# Altium schematic sheet STM32F030C8T6_IC.schdoc
size 123 x 93 mm
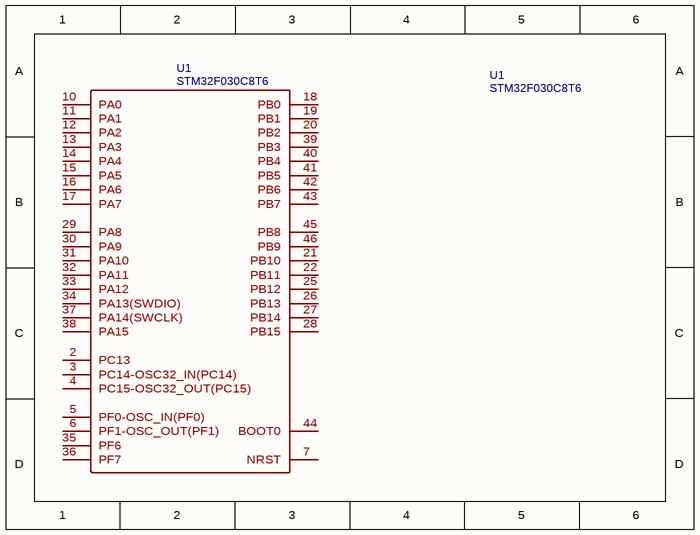
[diagram p0: STM32F030C8T6_IC.schdoc]

## Parts
(Parts that share a designator on the sheet are numbered #1, #2 ... from top to bottom, then left to right.)
U1#1  STM32F030C8T6  [LQFP-48_L7.0-W7.0-P0.50-LS9.0-BL]
U1#2  STM32F030C8T6  [LQFP-48_L7.0-W7.0-P0.50-LS9.0-BL]

## Nets

Not connected (* = marked no-connect by the designer): U1#2 2(PC13) 3(PC14-OSC32_IN(PC14)) 4(PC15-OSC32_OUT(PC15)) 5(PF0-OSC_IN(PF0)) 6(PF1-OSC_OUT(PF1)) 7(NRST) 10(PA0) 11(PA1) 12(PA2) 13(PA3) 14(PA4) 15(PA5) 16(PA6) 17(PA7) 18(PB0) 19(PB1) 20(PB2) 21(PB10) 22(PB11) 25(PB12) 26(PB13) 27(PB14) 28(PB15) 29(PA8) 30(PA9) 31(PA10) 32(PA11) 33(PA12) 34(PA13(SWDIO)) 35(PF6) 36(PF7) 37(PA14(SWCLK)) 38(PA15) 39(PB3) 40(PB4) 41(PB5) 42(PB6) 43(PB7) 44(BOOT0) 45(PB8) 46(PB9)

## Library data of the parts
U1#1 U1#2 = STM32F030C8T6: BOM_Manufacturer: ST(意法半导体); subpart_no: 1; tags: STM32; BOM_Supplier Part: C23922; BOM_Supplier: LCSC; BOM_Manufacturer Part: STM32F030C8T6; image: http://image.lceda.cn/szlcsc/C23922.jpg; BOM_JLCPCB Part Class: Basic Part; spicePre: U; spiceSymbolName: STM32F030C8T6